# Altium project ESP_32_MacroPad.PrjPcb
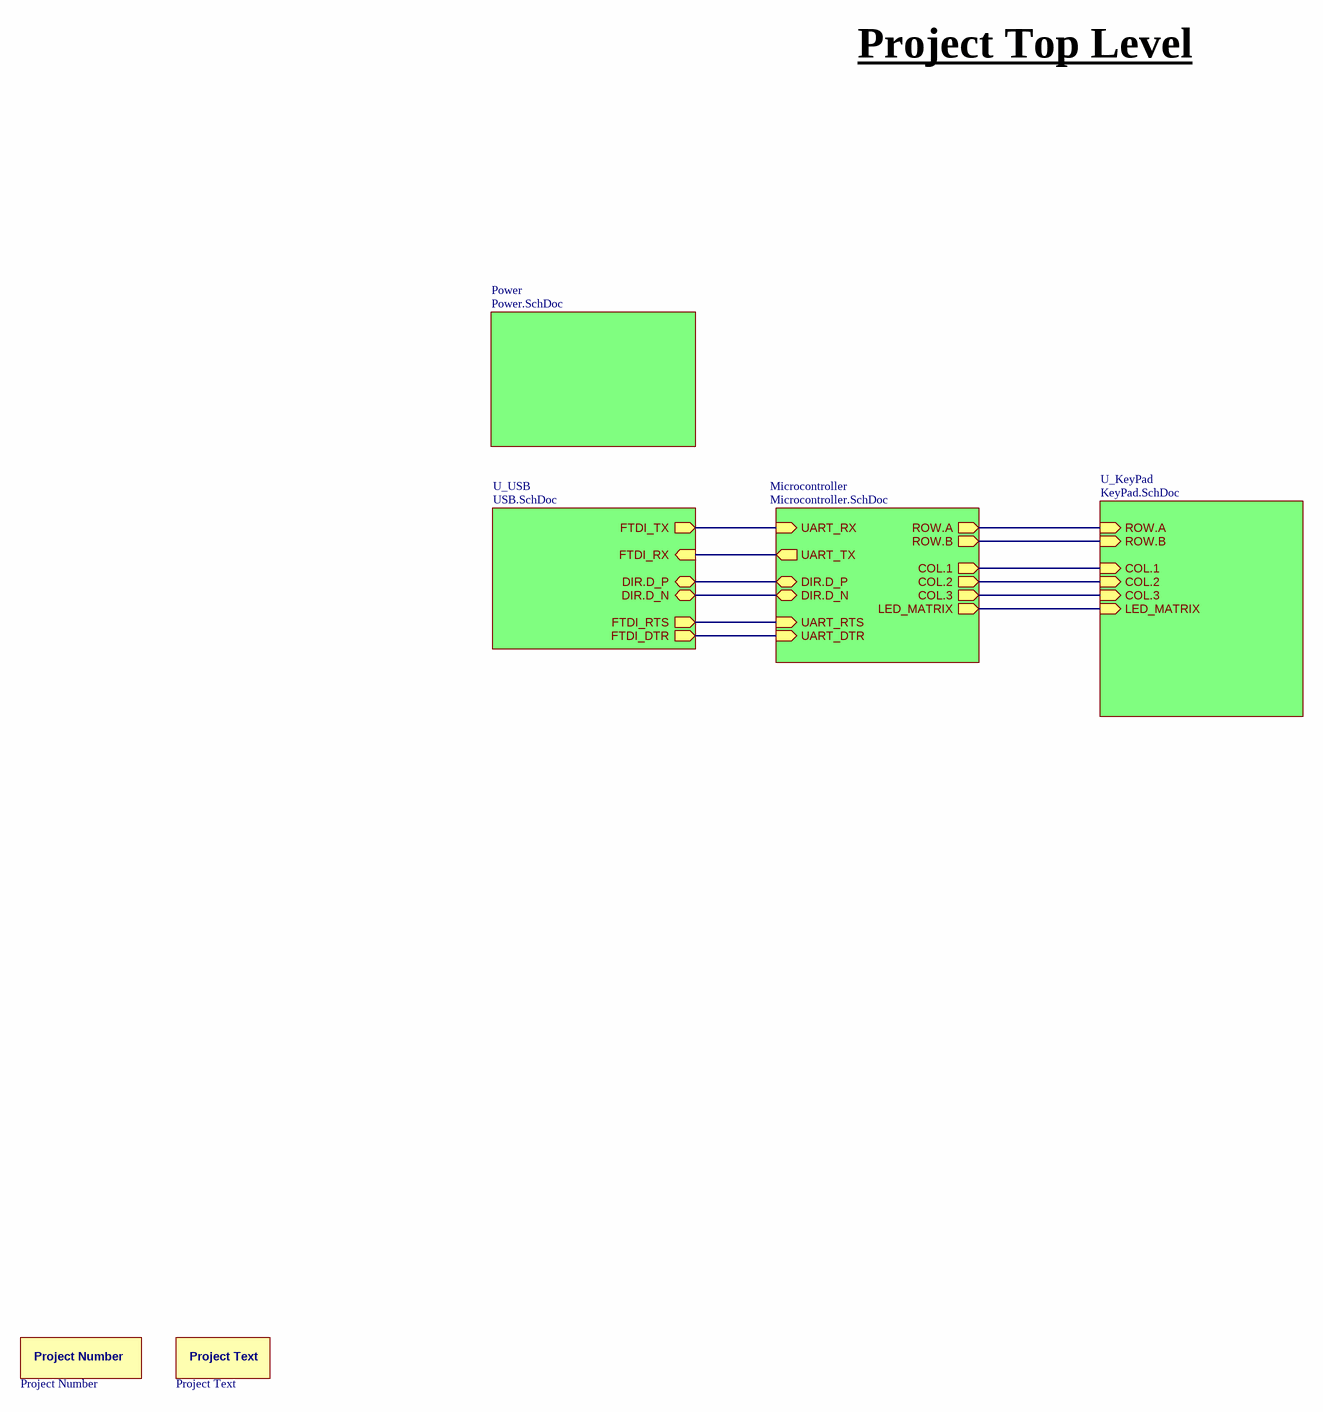
[diagram p0: Top.SchDoc]
CheckedDate: -; DesignDate: 05/03/2025; DesignYear: 2025; Project: ESP MACRO; ProjectNumber: RON-01; ProjectRevision: 0; ProjectStatus: DRAFT
5 sheets, 80 parts. Net scope: hierarchical (ports join the sheet entries above them; power ports are global).
Board files: ESP-MACRO-1.PcbDoc, 24-EL-MISC-Panel.PcbDoc
Sheets:
  Top.SchDoc
    Power = Power.SchDoc
    Microcontroller = Microcontroller.SchDoc
    U_USB = USB.SchDoc
    U_KeyPad = KeyPad.SchDoc

## Sheet Top.SchDoc
size 420 x 297 mm; Date: UNUSED; CompanyName: CMT; DrawnBy: UNUSED; Engineer: UNUSED; Organization: Curtin Motorsport Team; Address1: Rm 151 Building 206; Address2: Curtin University; Address3: Kent Street, Bentley; Address4: Western Australia; DocumentNumber: UNUSED; Revision: UNUSED; SheetNumber: 1; SheetTotal: 5; Year: UNUSED; SheetSize: A3; Time: UNUSED; ImagePath: UNUSED; Application_BuildNumber: UNUSED

### Parts
LOGO1  Project Number  [Project Number Overlay]  (no BOM)
LOGO2  Project Text  [Project Text-Footprint-1]  (no BOM)

### Sub-sheets
Microcontroller = Microcontroller.SchDoc: UART_RX (in), UART_TX (out), DIR.D_P (bidir), DIR.D_N (bidir), LED_MATRIX (out), COL.3 (out), COL.2 (out), COL.1 (out), ROW.B (out), ROW.A (out), UART_RTS (in), UART_DTR (in)
Power = Power.SchDoc: no entries
U_KeyPad = KeyPad.SchDoc: ROW.A (in), ROW.B (in), COL.1 (in), COL.2 (in), COL.3 (in), LED_MATRIX (in)
U_USB = USB.SchDoc: FTDI_TX (out), FTDI_RX (in), DIR.D_P (bidir), DIR.D_N (bidir), FTDI_RTS (out), FTDI_DTR (out)

### Nets
CBUS3: sheet Microcontroller/UART_DTR, sheet U_USB/FTDI_DTR
DIR.D_N: sheet Microcontroller/DIR.D_N, sheet U_USB/DIR.D_N
DIR.D_P: sheet Microcontroller/DIR.D_P, sheet U_USB/DIR.D_P
IO.8: sheet Microcontroller/ROW.B, sheet U_KeyPad/ROW.B
RXD: sheet Microcontroller/UART_TX, sheet U_USB/FTDI_RX
TXD: sheet Microcontroller/UART_RX, sheet U_USB/FTDI_TX
NetD3_1: sheet Microcontroller/COL.1, sheet U_KeyPad/COL.1
NetD4_1: sheet Microcontroller/COL.2, sheet U_KeyPad/COL.2
NetD5_1: sheet Microcontroller/COL.3, sheet U_KeyPad/COL.3
NetIC2_16: sheet Microcontroller/UART_RTS, sheet U_USB/FTDI_RTS
NetS1_1: sheet Microcontroller/ROW.A, sheet U_KeyPad/ROW.A
NetU1_18: sheet Microcontroller/LED_MATRIX, sheet U_KeyPad/LED_MATRIX

### Notes on the sheet
- Project Top Level
- Project:
- Title:
- Project Number:
- Size:
- Status:
- Revision:
- Year:
- Design Date:
- Author:
- Latest Revision Date:
- Sheet
- Checked:
- Checked
- of
- Date:

### Library data of the parts
LOGO1 = CMP-00004-5: Project Number Logo
LOGO2 = LOGO-00003-2

## Sheet Power.SchDoc: POWER
size 420 x 297 mm; Date: UNUSED; Author: RTU; CompanyName: CMT; DrawnBy: UNUSED; Engineer: UNUSED; Organization: Curtin Motorsport Team; Address1: Rm 151 Building 206; Address2: Curtin University; Address3: Kent Street, Bentley; Address4: Western Australia; DocumentNumber: UNUSED; Revision: UNUSED; SheetNumber: 2; SheetTotal: 5; Year: UNUSED; SheetSize: A3; Time: UNUSED; ImagePath: UNUSED; Application_BuildNumber: UNUSED
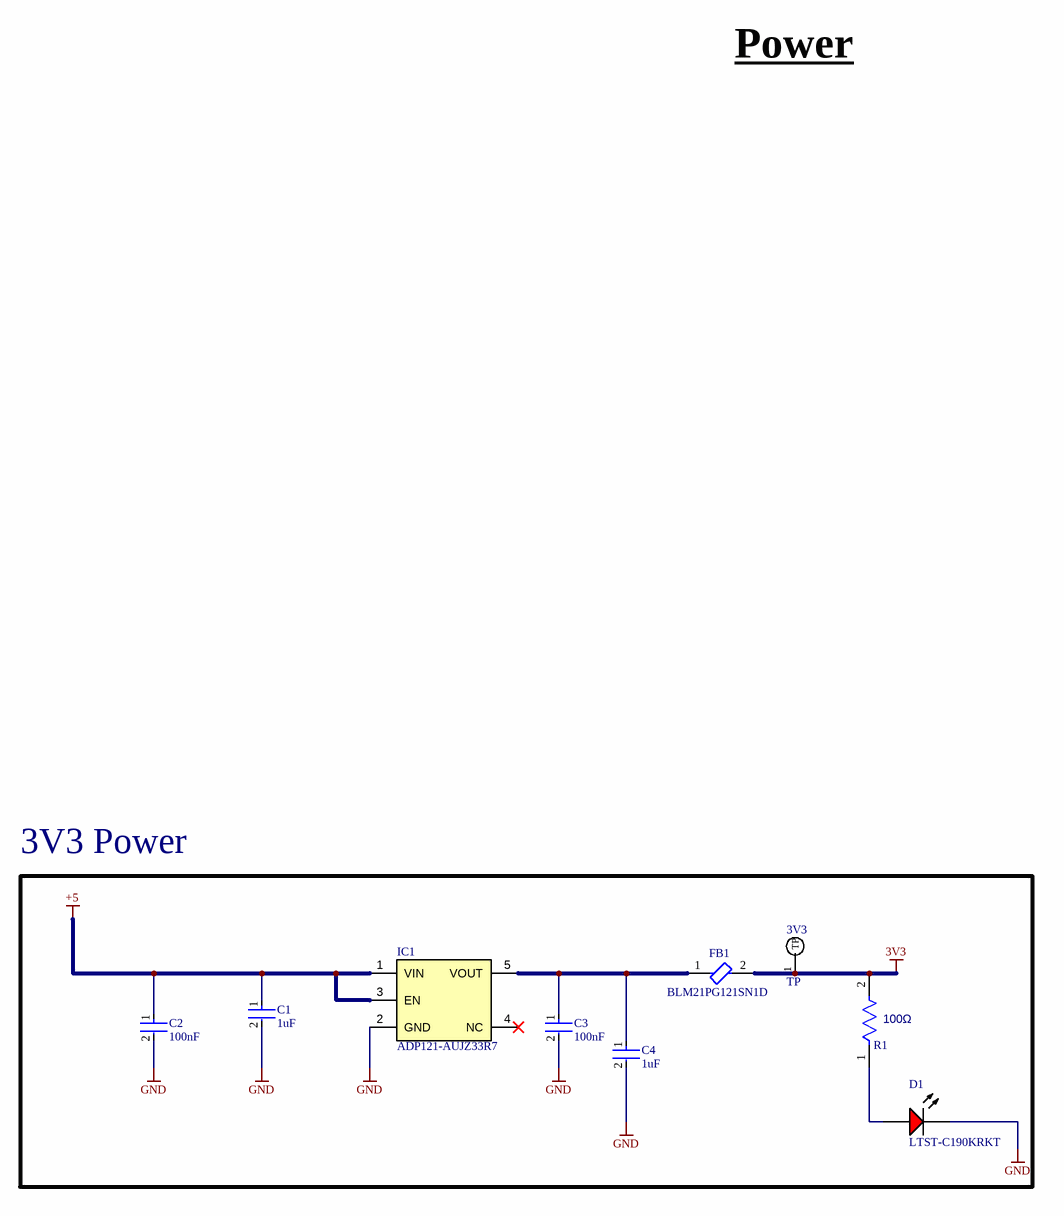
[diagram p1: Power.SchDoc]

### Parts
3V3  TP  [TestPad]
C1  1uF  [FP-CC0603-DA-MFG]
C2  100nF  [FP-GRM188-0_1-e0_2_0_55-IPC_A]
C3  100nF  [FP-GRM188-0_1-e0_2_0_55-IPC_A]
C4  1uF  [FP-CC0603-DA-MFG]
D1  LTST-C190KRKT  [LTST-C191KRKT_V]
FB1  BLM21PG121SN1D  [FP-BLM21-0_2-t0_85-e0_5-d-IPC_B]
IC1  ADP121-AUJZ33R7  [SOT95P280X100-5N]
R1  Resistance: 100Ω  [FP-RC0603-0_55-IPC_A]  (hidden comment: RC0603FR-07100RL)

### Blocks framed on the sheet
3V3 Power: 3V3 C1-C4 D1 FB1 IC1 R1

### Nets
3V3: 3V3.1(TP) FB1.2 R1.2
+5: C1.1 C2.1 IC1.1(VIN) IC1.3(EN)
GND: C1.2 C2.2 C3.2 C4.2 D1.2(K) IC1.2(GND)
NetC3_1: C3.1 C4.1 FB1.1 IC1.5(VOUT)
NetD1_1: D1.1(A) R1.1

Not connected (* = marked no-connect by the designer): IC1 4(NC)*

### Notes on the sheet
- Power
- Project:
- Title:
- Project Number:
- Size:
- Status:
- Revision:
- Year:
- Design Date:
- Author:
- Latest Revision Date:
- Sheet
- Checked:
- Checked
- of
- Date:

### Library data of the parts
3V3 = Test Points
C1 C4 = CMP-03422-000924-1: CAP CER 1UF 16V X7R 0603; Manufacturer: YAGEO; Manufacturer Part Number: CC0603KRX7R7BB105; Tolerance: 0.1; Temperature Coefficient: 15%; Material: Ceramic; Package: CC0603-DA; RoHS: TRUE; Device Class L2: Capacitors; Temperature Characteristic: X7R; Temperature: -55°C to +125°C; Temperature Range Low: -55°C; Automotive: No; ComponentLink2Description: Datasheet; Value: 1 uF; Lead Free: Yes; Capacitance: 1 uF; ComponentLink2URL: http://www.yageo.com/documents/recent/UPY-GPHC_X7R_6.3V-to-50V_18.pdf; Device Class L1: Passive Components; Voltage: 16 V; Octopart: https://octopart.com/cc0603krx7r7bb105-yageo-42271928; Category: Cap; Digikey Description: CAP CER 1UF 16V X7R 0603; Footprint Url: http://www.yageo.com/exep/pages/download/literatures/UPY-C_GEN_24.pdf; Height: 0.9mm; Voltage Rating: 16 V; Temperature Range High: +125°C; Mouser Description: Multilayer Ceramic Capacitor, CC Series, 1 - F, - 10%, X7R, 16 V, 0603 [1608 Metric]; Device Class L3: Ceramic Capacitors
C2 C3 = CMP-2006-02792-2: Chip Multilayer Ceramic Capacitors for General Purpose, 0603, 10uF, X5R, 15%, 20%, 6.3V; Packaging: Tape and Reel; Voltage Rating (DC): 6.3V; Width: 0.031inch; Termination: SMD/SMT; Dielectric: X5R; Package Quantity: 4000; Voltage Rating: 6.3V; Capacitance: 10uF; Case/Package: 0603; Min Operating Temperature: -55°C; Voltage: 6.3V; Length: 1.6mm; Thickness: 0.035inch; Lead Free: Lead Free; Depth: 0.8mm; Case Code (Imperial): 0603; Max Operating Temperature: 85°C; Material: Ceramic; Height: 0.8mm; Tolerance: 20%; Mount: Surface Mount; REACH SVHC: No SVHC; Radiation Hardening: No; Case Code (Metric): 1608
D1 = CMP-007-00024-3: LED Uni-Color Red, 62.5 mW, 25 mA, -30 to 85 degC, 2-Pin SMD, RoHS, Tape and Reel; Manufacturer: Lite-On; Manufacturer_Name: Vishay; Power: 75mW; Forward Voltage: 2V; Luminous Intensity: 54mcd; Lens Style: Diffused; Viewing Angle: 130degrees; Forward Current: 20mA; Manufacturer URL: http://www.us.liteon.com/; Case/Package: 0603; Datasheet Version: Rev. F, 05/2013; Package Reference: C191KRKT; Datasheet URL: http://optoelectronics.liteon.com/upload/download/DS-22-99-0151/S_110_LTST-C190KRKT.pdf; Package Description: 2-Pin Surface Mount Device, Body 1.6 x 0.8 mm; Nominal Vf: 2V; Packaging: TapeandReel; RoHS Compliant: True; Pins: 2; Illumination Colour: Red; Colour: Red; Mounting Technology: SM; Package Quantity: 3000; Min Operating Temperature: -55°C; Max Operating Temperature: 85°C; Manufacturer_Part_Number: LTST-C190KRKT
FB1 = CMP-00002-2: Ferrite Beads Multi-Layer 120Ohm 25% 100MHz 3A 30mOhm DCR 0805 Paper T/R; Manufacturer_Name: Murata; Material: Steel,Ferrite; DC Resistance (DCR): 30mR; Impedance: 120R; Case/Package: 0805; Case Code (Imperial): 0805; Min Operating Temperature: -55°C; Max Operating Temperature: 125°C; Current Rating: 3A; Manufacturer_Part_Number: BLM21PG121SN1D
IC1 = CMP-009-000019-2: Integrated Circuit; Manufacturer_Name: Analog Devices; Manufacturer_Part_Number: ADP121-AUJZ33R7; Datasheet Link: https://datasheet.lcsc.com/szlcsc/Analog-Devices-ADI-ADP121-AUJZ33R7_C50499.pdf; Source: SamacSys.SchLib; Mouser Price/Stock: https://www.mouser.co.uk/ProductDetail/Analog-Devices/ADP121-AUJZ33R7?qs=BpaRKvA4VqHby1qhPTxfCw%3D%3D; Design Item ID: ADP121-AUJZ33R7; Height: 1mm; Mouser Part Number: 584-ADP121-AUJZ33R7
R1 = CMP-2100-03663-2: NexarPartId: 55402879; Tolerance: 1%; Voltage Rating (DC): 50V; Power Rating: 100mW; Temperature Coefficient: 100ppm/°C; Number of Pins: 2; Height: 450µm; Military Standard: Not; Case Code (Imperial): 0603; Termination: SMD/SMT; Lead Free: Lead Free; Max Operating Temperature: 155°C; Case Code (Metric): 0603; Voltage Rating: 50V; Width: 800µm; Composition: Thick Film; Depth: 800µm; REACH SVHC: Unknown; Min Operating Temperature: -55°C; Packaging: Tape & Reel; Length: 1.6mm; Case/Package: 0603; RoHS: Compliant; Schedule B: 8533210045, 8533210045|8533210045|8533210045|8533210045|8533210045|8533210045|8533210045|8533210045|8533210045|8533210045|8533210045|8533210045|8533210045|8533210045|8533210045|8533210045|8533210045|8533210045|8533210045|8533210045|8533210045|8533210045|8533210045|85

## Sheet Microcontroller.SchDoc: Micro
size 420 x 297 mm; Date: UNUSED; CompanyName: CMT; DrawnBy: UNUSED; Engineer: UNUSED; Organization: Curtin Motorsport Team; Address1: Rm 151 Building 206; Address2: Curtin University; Address3: Kent Street, Bentley; Address4: Western Australia; DocumentNumber: UNUSED; Revision: UNUSED; SheetNumber: 3; SheetTotal: 5; Year: UNUSED; SheetSize: A3; Time: UNUSED; ImagePath: UNUSED; Application_BuildNumber: UNUSED
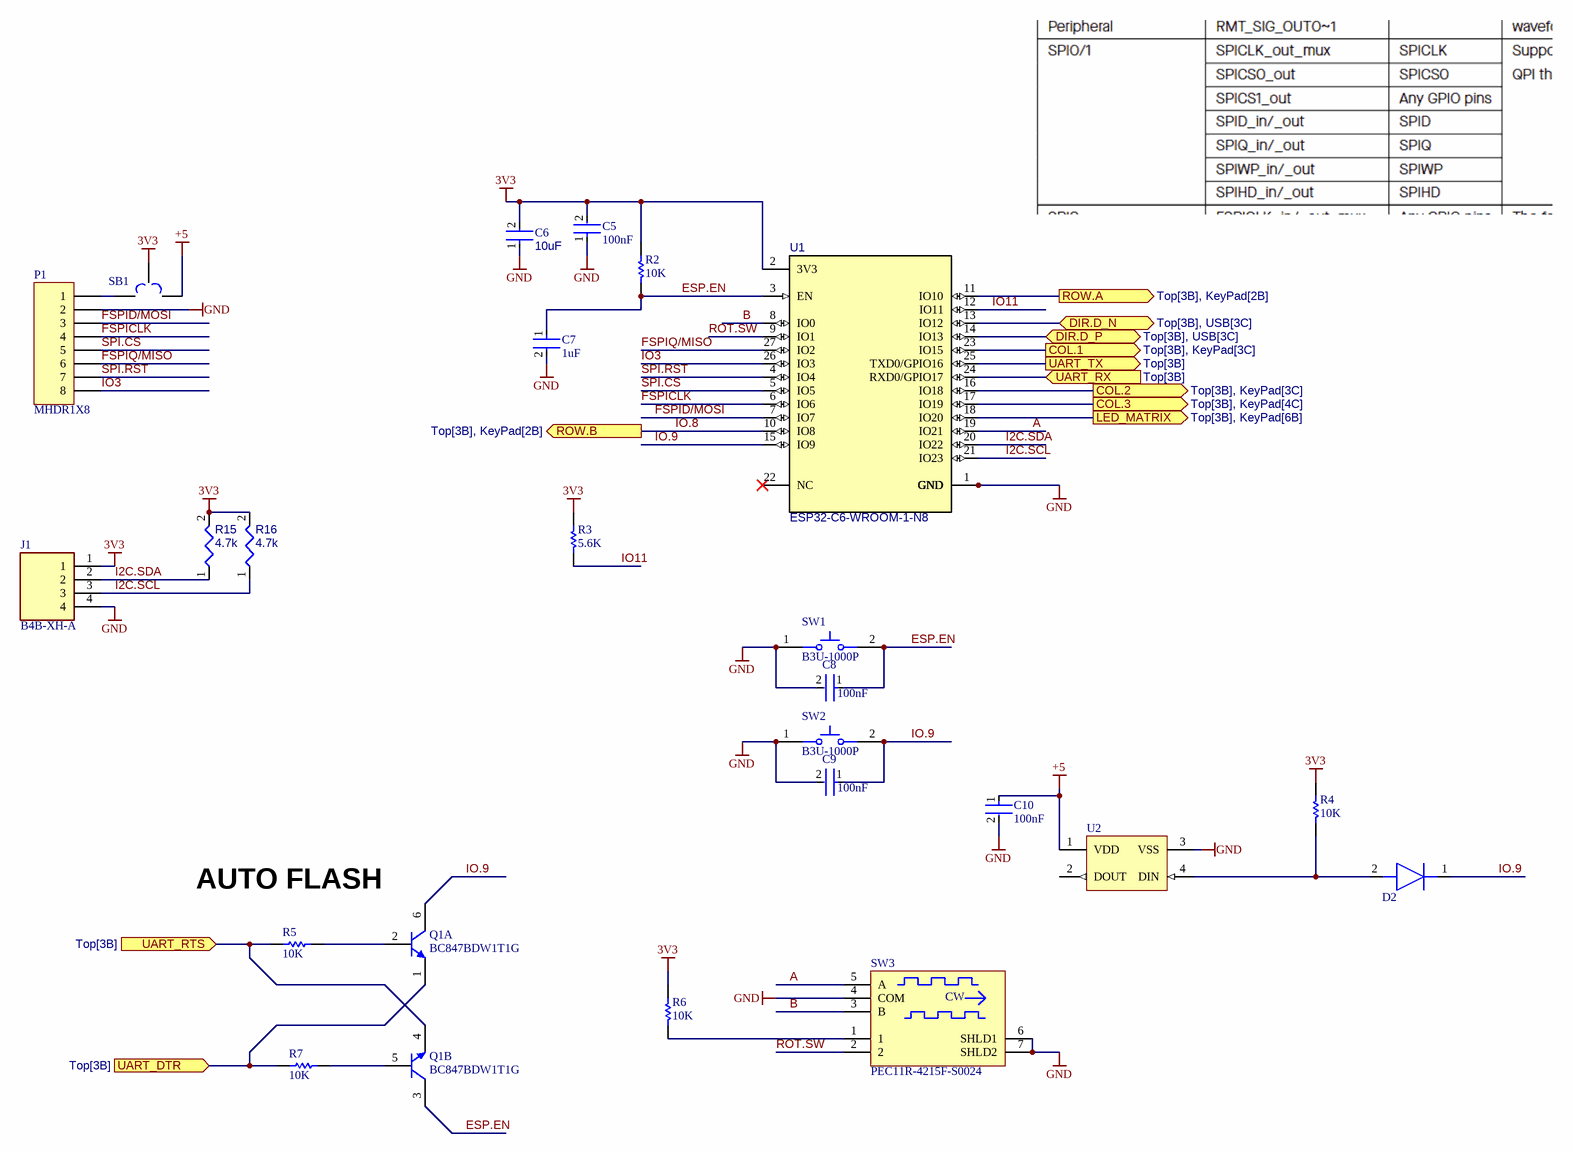
[diagram p2: Microcontroller.SchDoc]

### Parts
C5  100nF  [FP-GRM188-0_1-e0_2_0_55-IPC_A]
C6  Capacitance: 10uF  [FP-C1608-080-IPC_A]  (hidden comment: C1608X5R1E106M080AC)
C7  1uF  [FP-CC0603-DA-MFG]
C8  100nF  [FP-GRM188-0_1-e0_2_0_55-IPC_A]
C9  100nF  [FP-GRM188-0_1-e0_2_0_55-IPC_A]
C10  100nF  [FP-GRM188-0_1-e0_2_0_55-IPC_A]
D2  NSVR1020MW2T1G  [SOD2512X110N]  (value not drawn)
J1  B4B-XH-A  [B4BXHA]
P1  MHDR1X8  [MHDR1X8]
Q1  BC847BDW1T1G  [ONSC-SOT-363-6-419B-02_W_V]  (parts A,B of 2)
R2  10K  [RESC1609X50X30NL10T20]
R3  5.6K  [RESC1609X50X30NL10T20]
R4  10K  [RESC1609X50X30NL10T20]
R5  10K  [RESC1609X50X30NL10T20]
R6  10K  [RESC1609X50X30NL10T20]
R7  10K  [RESC1609X50X30NL10T20]
R15  value 4.7k  [RESC1608X55X25ML10T15]  (hidden comment: Resistor 4k7 +/-1% 0603 100 mW)
R16  value 4.7k  [RESC1608X55X25ML10T15]  (hidden comment: Resistor 4k7 +/-1% 0603 100 mW)
SB1  3 POS Solder Bridge  [3 POS Solder Bridge-Footprint-1]  (value not drawn)  (no BOM)
SW1  B3U-1000P  [OMRON-B3U-1000_V]
SW2  B3U-1000P  [OMRON-B3U-1000_V]
SW3  PEC11R-4215F-S0024  [BOUR-PEC11R-4XXXF-SXXXX_V]
U1  ESP32-C6-WROOM-1-N8  [ESP32-C6-WROOM-1-N8-Footprint-1]
U2  WS2812B  [ADAI-WS2812B_V]  (value not drawn)

### Ports
COL.1 (out, see Top[3B], KeyPad[3C]), COL.2 (out, see Top[3B], KeyPad[3C]), COL.3 (out, see Top[3B], KeyPad[4C]), DIR.D_N (bidir, see Top[3B], USB[3C]), DIR.D_P (bidir, see Top[3B], USB[3C]), LED_MATRIX (out, see Top[3B], KeyPad[6B]), ROW.A (out, see Top[3B], KeyPad[2B]), ROW.B (out, see Top[3B], KeyPad[2B]), UART_DTR (in, see Top[3B]), UART_RTS (in, see Top[3B]), UART_RX (in, see Top[3B]), UART_TX (out, see Top[3B])

### Nets
3V3: C5.2 C6.2 J1.1 R2.1 R3.1 R4.1 R6.1 R15.2 R16.2 SB1.2 U1.2(3V3)
+5: C10.1 SB1.3 U2.1(VDD)
GND: C5.1 C6.1 C7.2 C8.2 C9.2 C10.2 J1.4 P1.2 SW1.1 SW2.1 SW3.4(COM) SW3.6(SHLD1) SW3.7(SHLD2) U1.1(GND) U1.28(GND) U1.29_1(GND) U1.29_2(GND) U1.29_3(GND) U1.29_4(GND) U1.29_5(GND) U1.29_6(GND) U1.29_7(GND) U1.29_8(GND) U1.29_9(GND) U2.3(VSS)
A: SW3.5(A) U1.19(IO21)
B: SW3.3(B) U1.8(IO0)
CBUS3: Q1.1(E) R7.1 ; port UART_DTR
DIR.D_N: U1.13(IO12) ; port DIR.D_N
DIR.D_P: U1.14(IO13) ; port DIR.D_P
ESP.EN: C7.1 C8.1 Q1.3(C) R2.2 SW1.2 U1.3(EN)
FSPICLK: P1.4 U1.6(IO6)
FSPID/MOSI: P1.3 U1.7(IO7)
FSPIQ/MISO: P1.6 U1.27(IO2)
I2C.SCL: J1.3 R16.1 U1.21(IO23)
I2C.SDA: J1.2 R15.1 U1.20(IO22)
IO3: P1.8 U1.26(IO3)
IO11: R3.2 U1.12(IO11)
IO.8: U1.10(IO8) ; port ROW.B
IO.9: C9.1 D2.1(K) Q1.6(C) SW2.2 U1.15(IO9)
ROT.SW: SW3.2 U1.9(IO1)
RXD: U1.25(TXD0/GPIO16) ; port UART_TX
SPI.CS: P1.5 U1.5(IO5)
SPI.RST: P1.7 U1.4(IO4)
TXD: U1.24(RXD0/GPIO17) ; port UART_RX
NetD2_2: D2.2(A) R4.2 U2.4(DIN)
NetD3_1: U1.23(IO15) ; port COL.1
NetD4_1: U1.16(IO18) ; port COL.2
NetD5_1: U1.17(IO19) ; port COL.3
NetIC2_16: Q1.4(E) R5.1 ; port UART_RTS
NetP1_1: P1.1 SB1.1
NetQ1_2: Q1.2(B) R5.2
NetQ1_5: Q1.5(B) R7.2
NetR6_2: R6.2 SW3.1
NetS1_1: U1.11(IO10) ; port ROW.A
NetU1_18: U1.18(IO20) ; port LED_MATRIX

Not connected (* = marked no-connect by the designer): U1 22(NC)*; U2 2(DOUT)

### Notes on the sheet
- (near R5) AUTO FLASH
- Project:
- Title:
- Project Number:
- Size:
- Status:
- Revision:
- Year:
- Design Date:
- Author:
- Latest Revision Date:
- Sheet
- Checked:
- Checked
- of
- Date:
- (in symbol CMP-011-00007-2) CW

### Library data of the parts
C5 C8-C10 = CMP-2006-02792-2: as C2 on sheet Power; Packaging: Tape and Reel; Voltage Rating (DC): 6.3V; Width: 0.031inch; Termination: SMD/SMT; Dielectric: X5R; Package Quantity: 4000; Voltage Rating: 6.3V; Capacitance: 10uF; Case/Package: 0603; Min Operating Temperature: -55°C; Voltage: 6.3V; Length: 1.6mm; Thickness: 0.035inch; Lead Free: Lead Free; Depth: 0.8mm; Case Code (Imperial): 0603; Max Operating Temperature: 85°C; Material: Ceramic; Height: 0.8mm; Tolerance: 20%; Mount: Surface Mount; REACH SVHC: No SVHC; Radiation Hardening: No; Case Code (Metric): 1608
C6 = CMP-2000-05442-2: CAP CER 10UF 25V X5R 0603; Dielectric Material: Ceramic; Tolerance: 20%; Dielectric: X5R; Length: 1.6mm; Termination: SMD/SMT; Depth: 0.8mm; RoHS Compliant: Yes; Construction: Flat; Weight: 7.1E-05oz; Thickness: 0.039inch; Packaging: Tape and Reel; Min Operating Temperature: -55°C; Case Code (Imperial): 0603; Case/Package: 0603; Height: 0.8mm; Case Code (Metric): 1608; Voltage Rating: 25V; Resistor Type: Ceramic; Voltage Rating (DC): 25V; Max Operating Temperature: 85°C; REACH SVHC: No SVHC; Lead Free: Lead Free; Series: C; Width: 0.8mm; Mount: Surface Mount; Package Quantity: 1
C7 = CMP-03422-000924-1: as C1 on sheet Power; Package: CC0603-DA; RoHS: TRUE; Device Class L2: Capacitors; Temperature Characteristic: X7R; Temperature: -55°C to +125°C; Temperature Range Low: -55°C; Automotive: No; ComponentLink2Description: Datasheet; Value: 1 uF; Lead Free: Yes; Capacitance: 1 uF; ComponentLink2URL: http://www.yageo.com/documents/recent/UPY-GPHC_X7R_6.3V-to-50V_18.pdf; Device Class L1: Passive Components; Voltage: 16 V; Octopart: https://octopart.com/cc0603krx7r7bb105-yageo-42271928; Category: Cap; Digikey Description: CAP CER 1UF 16V X7R 0603; Footprint Url: http://www.yageo.com/exep/pages/download/literatures/UPY-C_GEN_24.pdf; Height: 0.9mm; Voltage Rating: 16 V; Temperature Range High: +125°C; Mouser Description: Multilayer Ceramic Capacitor, CC Series, 1 - F, - 10%, X7R, 16 V, 0603 [1608 Metric]; Device Class L3: Ceramic Capacitors
D2 = CMP-020-000003-1: Diode; Manufacturer_Name: onsemi; Design Item ID: NSVR1020MW2T1G; Datasheet Link: http://www.onsemi.com/pub/Collateral/NSR1020MW2T1-D.PDF; Arrow Price/Stock: https://www.arrow.com/en/products/nsvr1020mw2t1g/on-semiconductor; Height: 1.1mm; Mouser Part Number: 863-NSVR1020MW2T1G; Mouser Price/Stock: https://www.mouser.co.uk/ProductDetail/onsemi/NSVR1020MW2T1G?qs=tCMd4XlZ%2FiDUu7qH%252Bxas4w%3D%3D; Manufacturer_Part_Number: NSVR1020MW2T1G; Source: SamacSys.SchLib; Arrow Part Number: NSVR1020MW2T1G
J1 = CMP-019-000017-1: Connector; Manufacturer_Name: JST (JAPAN SOLDERLESS TERMINALS); Height: 7mm; Datasheet Link: https://www.jst-mfg.com/product/pdf/eng/eXH.pdf; Design Item ID: B4B-XH-A; Manufacturer_Part_Number: B4B-XH-A; Source: SamacSys.SchLib
P1 = CMP-011-000321-1: Header, 8-Pin; Signal Integrity: Connector; LatestRevisionDate: 17-Jul-2002; Publisher: Altium Limited; LatestRevisionNote: Re-released for DXP Platform.; Source: Miscellaneous Connectors.SchLib; Component Type: Standard; Pin Count: 8; Design Item ID: MHDR1X8
Q1 = CMP-1048-00875-1: Dual General Purpose Transistors, NPN, 6-Pin SOT-363, Pb-Free, Tape and Reel; Manufacturer: On Semiconductor; fT Min (MHz): 100; IC Continuous (A): 0.1; Polarity: Dual NPN; ComponentLink3Description: Package Specification; PackageReference: SOT-363-6-419B-02_W; RoHS: TRUE; PackageVersion: Rev. W, 01/2006; Packing: Tape and Reel; Mounting Technology: Surface Mount; ComponentLink3URL: http://www.onsemi.com/pub_link/Collateral/NTJD4001N-D.PDF; ComponentLink2URL: http://www.onsemi.cn/pub_link/Collateral/BC846BDW1T1-D.PDF; ComponentLink2Description: Datasheet; ComponentLink1Description: Manufacturer URL; PartNumber: BC847BDW1T1G; DatasheetVersion: Rev. 9; PackageDescription: 6-Pin Small Outline Transistor, Body 2 x 1.25 mm, Pitch 0.65 mm; ComponentLink1URL: http://www.onsemi.com/
R2-R7 = CMP-1012-00708-2: Part Number: CRCW060356K0FKEA; Manufacturer: Vishay Dale
R15 R16 = CMP-009-00031-7: Chip Resistor, 4.7 KOhm, +/- 1%, 0.1 W, -55 to 155 degC, 0603 (1608 Metric); Manufacturer_Part_Number: RC0603FR-134K7L; Manufacturer_Name: Yageo; Power: 100mW; Min Operating Temperature: -55°C; Case/Package: 0603; RoHS Compliant: True; Tolerance: 1%; Max Operating Temperature: 155°C; Pins: 2; Mounting Technology: SM
SB1 = CMP-016-000000-3: 3 position solder bridge; Source: StrainComponents.SchLib; Design Item ID: 3 POS SB
SW1 SW2 = CMP-011-00000-2: Tactile Switch, SPST-NO, 0.05 A, 12 V, -25 to 70 degC, 2-Pin SMD, RoHS, Tape and Reel; Manufacturer: Omron Electronic Components; IP Rating: IP40; Current Rating: 50mA; Max Contact Resistance: 100mohm; Operating Force: 153gf; Throw Configuration: SPST; Resistance: 0.1Ohm; Max Voltage Rating (DC): 12V; Contact Material: Silver; Max Current Rating: 50mA; Datasheet URL: http://www.omron.com/ecb/products/pdf/en-b3u.pdf; Mounting Technology: SM; Case/Package: B3U-1000; Packaging: TapeandReel; Package Reference: B3U-1000; Manufacturer URL: http://www.omron.com/; Datasheet Version: Jan-15; RoHS Compliant: True; Max Operating Temperature: 70°C; Contact Current Rating: 50mA; Package Quantity: 3500; Package Description: 2-Pin Surface Mount Device, Body 3 x 2.5 mm; Voltage Rating (DC): 12V; Min Operating Temperature: -25°C; Voltage Rating: 12V
SW3 = CMP-011-00007-2: 12 mm Incremental Encoder, 24 Detent, -30 to 70 degC, 5-Pin THD, RoHS, Bulk; Manufacturer: Bourns; Channels: 2; RoHS Compliant: True; Product Type: Mechanical; Datasheet Version: Jul-14; Package Quantity: 150; Manufacturer URL: http://www.bourns.com/; Case/Package: PEC11R-4XXXF-SXXXX; Packaging: Bulk; Package Reference: PEC11R-4XXXF-SXXXX; Min Operating Temperature: -30°C; Max Operating Temperature: 70°C; Datasheet URL: http://www.bourns.com/docs/Product-Datasheets/PEC11R.pdf; Mounting Technology: TH; Package Description: 5-Pin Through Hole Device, Body 12.5 x 13.4 mm
U1 = CMP-021-00007-3: ESP32-C6-WROOM-1-N8 Engineering Module - 8 MB Quad SPI Flash; Nominal Supply Voltage: 3.3V; Frequency: 128MHz; Flash: 8 MB; Mounting Technology: SMT; Case/Package: 28-SMD Module; Pins: 28
U2 = CMP-007-00035-2: Intelligent Control LED Integrated Light Source, 3.5 to 5.3 V, -25 to 80 degC, 4-Pin SMD, RoHS, Bulk; Manufacturer: Adafruit Industries; Datasheet URL: https://cdn-shop.adafruit.com/datasheets/WS2812B.pdf; Manufacturer URL: https://www.adafruit.com/; Datasheet Version: May-13; Case/Package: WS2812B; Mounting Technology: SM; RoHS Compliant: False; Package Description: 4-Pin Surface Mount Device, Body 5 x 5 mm, Pitch 3.3 mm; Package Reference: WS2812B

## Sheet USB.SchDoc
size 420 x 297 mm; Date: UNUSED; CompanyName: CMT; DrawnBy: UNUSED; Engineer: UNUSED; Organization: Curtin Motorsport Team; Address1: Rm 151 Building 206; Address2: Curtin University; Address3: Kent Street, Bently; Address4: Western Australia; DocumentNumber: UNUSED; Revision: UNUSED; SheetNumber: 5; SheetTotal: 5; Year: UNUSED; SheetSize: A3; Time: UNUSED; ImagePath: UNUSED; Application_BuildNumber: UNUSED
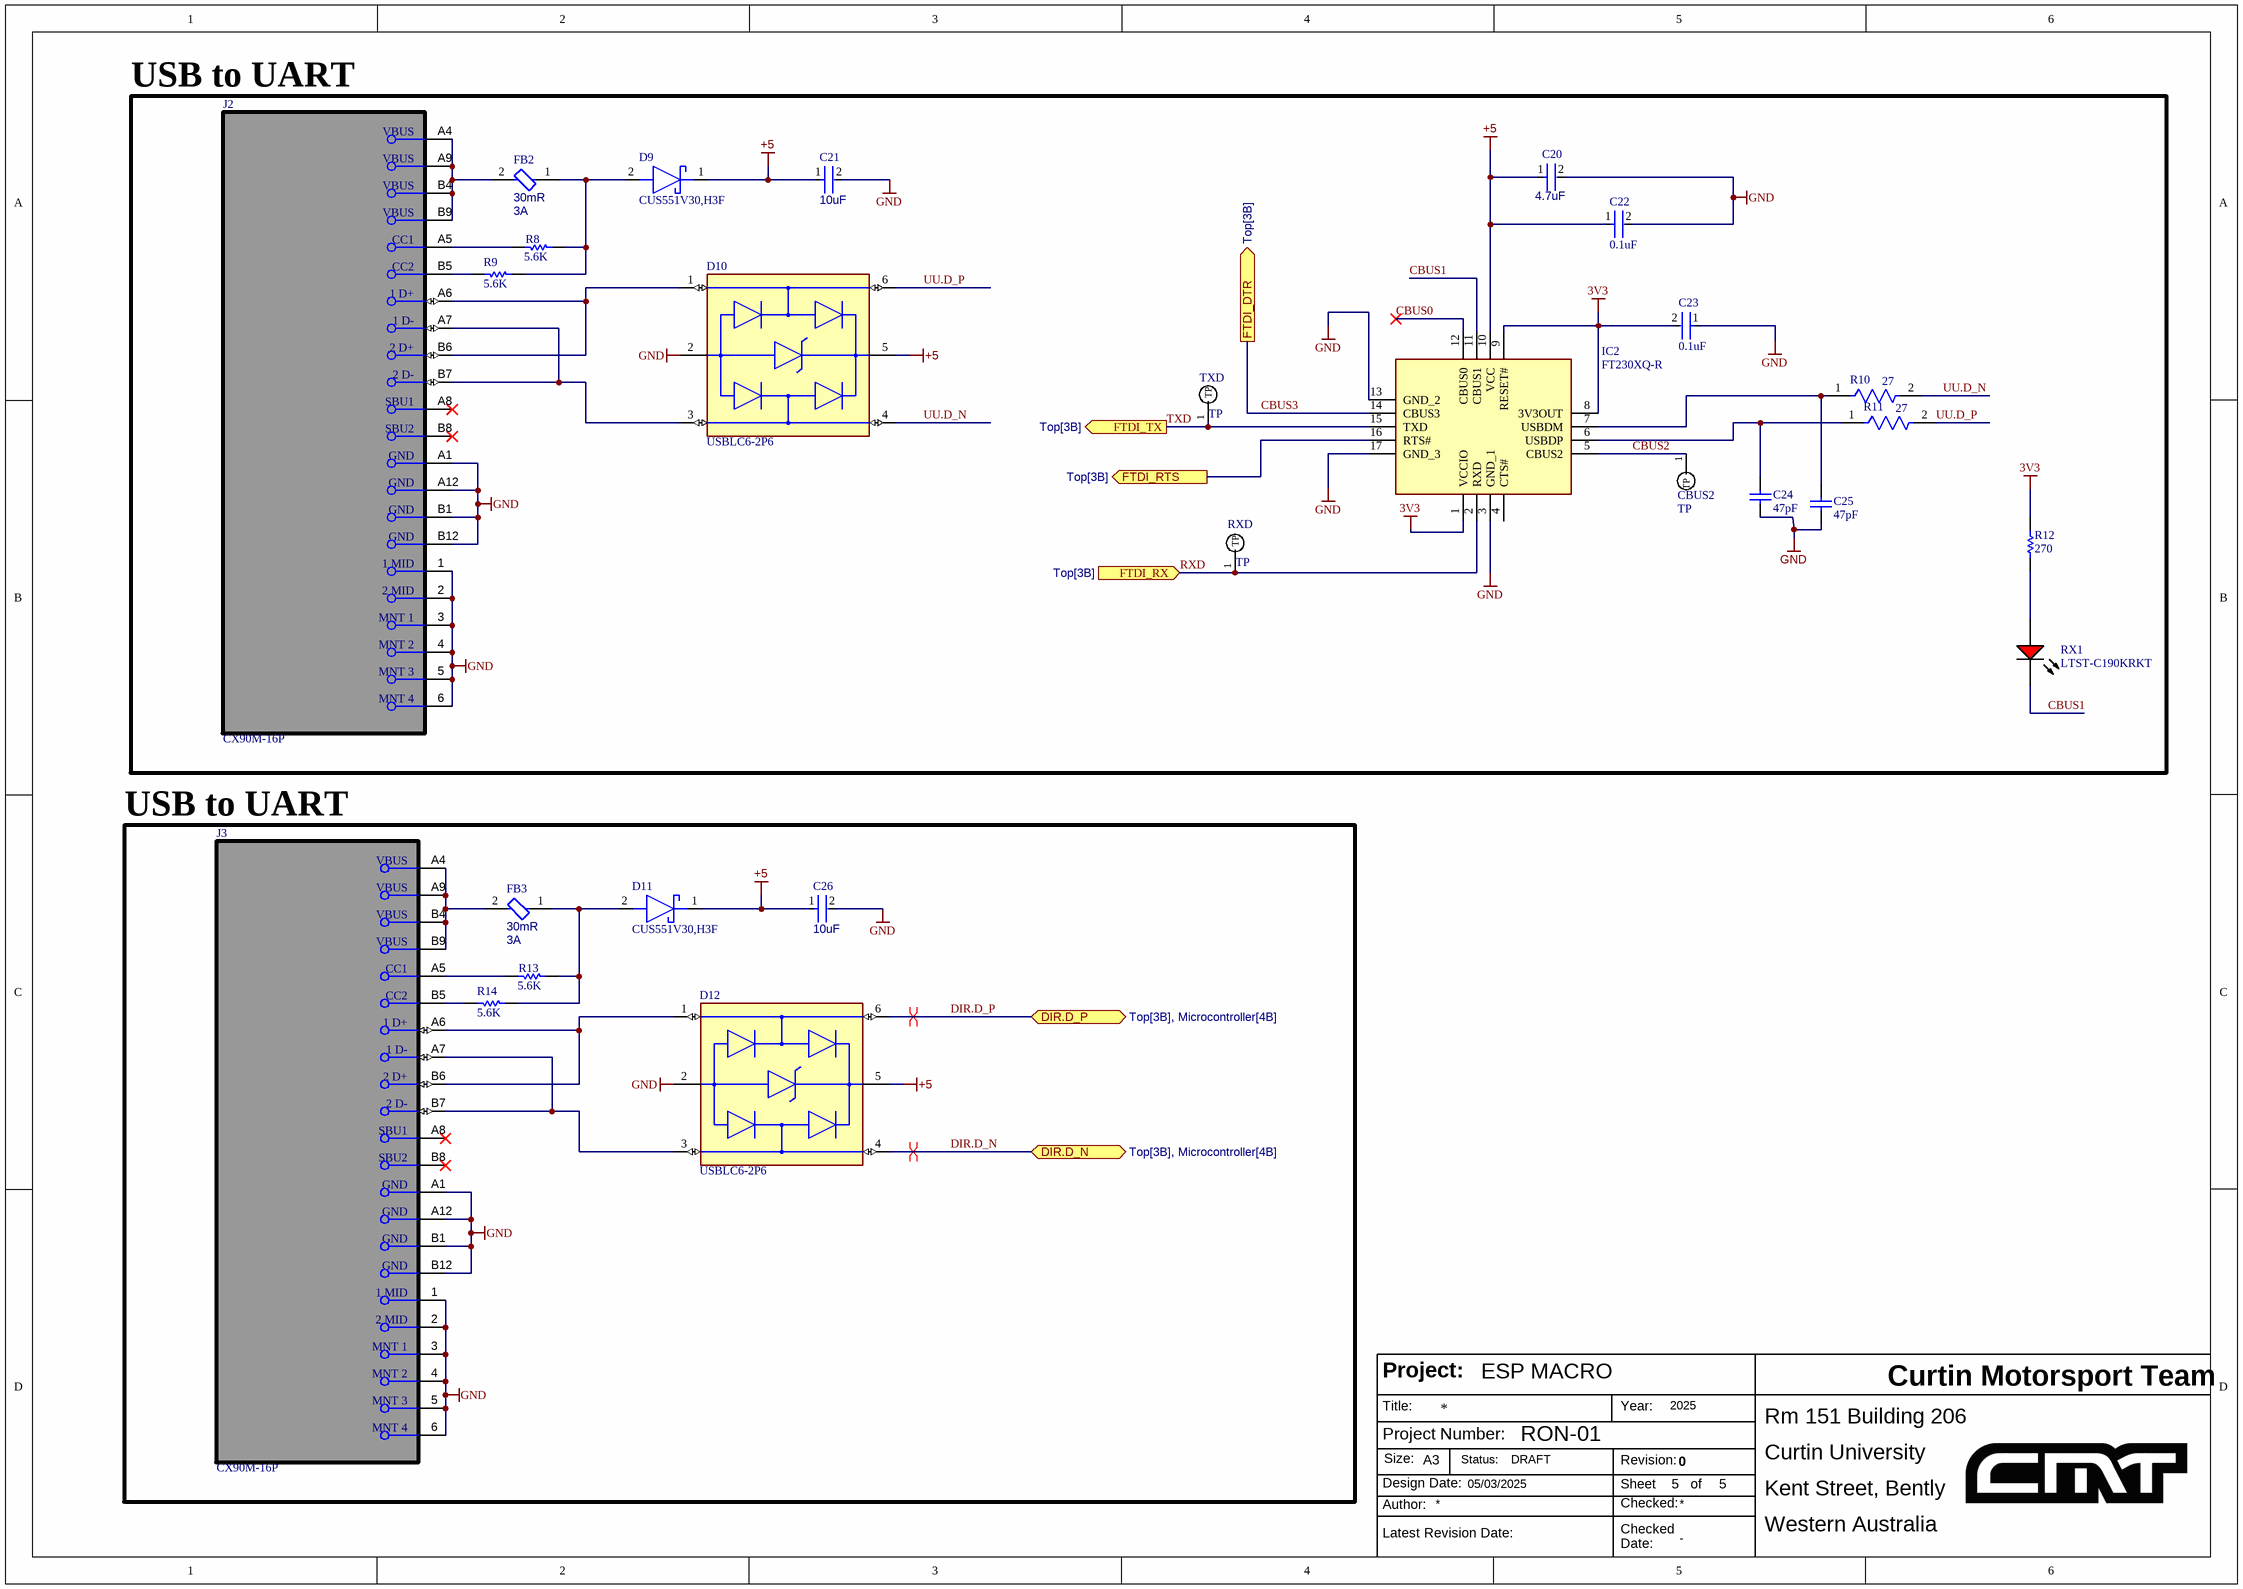
[diagram p3: USB.SchDoc]

### Parts
C20  Capacitance: 4.7uF  [FP-GRM188-0_15-IPC_C]  (hidden comment: GRM188R61E475KE11D)
C21  Capacitance: 10uF  [FP-C1608-080-IPC_A]  (hidden comment: C1608X5R1E106M080AC)
C22  0.1uF  [FP-C0603C-CF-MFG]
C23  0.1uF  [FP-C0603C-CF-MFG]
C24  47pF  [CAPC1608X90X35NL10T15]
C25  47pF  [CAPC1608X90X35NL10T15]
C26  Capacitance: 10uF  [FP-C1608-080-IPC_A]  (hidden comment: C1608X5R1E106M080AC)
CBUS2  TP  [TestPad]
D9  CUS551V30,H3F  [1SS357TPH3F]
D10  USBLC6-2P6  [FP-SOT-666-MFG]
D11  CUS551V30,H3F  [1SS357TPH3F]
D12  USBLC6-2P6  [FP-SOT-666-MFG]
FB2  DC Resistance (DCR): 30mR  Current Rating: 3A  [FP-BLM21-0_2-t0_85-e0_5-d-IPC_B]  (hidden comment: BLM21PG121SN1D)
FB3  DC Resistance (DCR): 30mR  Current Rating: 3A  [FP-BLM21-0_2-t0_85-e0_5-d-IPC_B]  (hidden comment: BLM21PG121SN1D)
IC2  FT230XQ-R  [QFN65P400X400X80-17N]
J2  CX90M-16P  [FP-CX90M-16P-MFG]
J3  CX90M-16P  [FP-CX90M-16P-MFG]
R8  5.6K  [RESC1609X50X30NL10T20]
R9  5.6K  [RESC1609X50X30NL10T20]
R10  27  [FP-ERJ3EK-IPC_B]
R11  27  [FP-ERJ3EK-IPC_B]
R12  270  [RESC1609X50X30NL10T20]
R13  5.6K  [RESC1609X50X30NL10T20]
R14  5.6K  [RESC1609X50X30NL10T20]
RX1  LTST-C190KRKT  [LTST-C191KRKT_V]
RXD  TP  [TestPad]
TXD  TP  [TestPad]

### Blocks framed on the sheet
USB to UART: C20-C25 CBUS2 D9 D10 FB2 IC2 J2 R8-R12 RX1 RXD TXD
USB to UART: C26 D11 D12 FB3 J3 R13 R14

### Ports
DIR.D_N (bidir, see Top[3B], Microcontroller[4B]), DIR.D_P (bidir, see Top[3B], Microcontroller[4B]), FTDI_DTR (out, see Top[3B]), FTDI_RTS (out, see Top[3B]), FTDI_RX (in, see Top[3B]), FTDI_TX (out, see Top[3B])

### Nets
3V3: C23.2 IC2.1(VCCIO) IC2.8(3V3OUT) IC2.9(RESET#) R12.2
+5: C20.1 C21.1 C22.1 C26.1 D9.1(K) D10.5(VBUS) D11.1(K) D12.5(VBUS) IC2.10(VCC)
GND: C20.2 C21.2 C22.2 C23.1 C24.1 C25.1 C26.2 D10.2(GND) D12.2(GND) IC2.3(GND_1) IC2.13(GND_2) IC2.17(GND_3) J2.1(1_MID) J2.2(2_MID) J2.3(MNT_1) J2.4(MNT_2) J2.5(MNT_3) J2.6(MNT_4) J2.A1(GND) J2.A12(GND) J2.B1(GND) J2.B12(GND) J3.1(1_MID) J3.2(2_MID) J3.3(MNT_1) J3.4(MNT_2) J3.5(MNT_3) J3.6(MNT_4) J3.A1(GND) J3.A12(GND) J3.B1(GND) J3.B12(GND)
CBUS0: IC2.12(CBUS0)
CBUS1: IC2.11(CBUS1) RX1.2(K)
CBUS2: CBUS2.1(TP) IC2.5(CBUS2)
CBUS3: IC2.14(CBUS3) ; port FTDI_DTR
DIR.D_N: D12.4(I/O2) ; port DIR.D_N
DIR.D_P: D12.6(I/O1) ; port DIR.D_P
RXD: IC2.2(RXD) RXD.1(TP) ; port FTDI_RX
TXD: IC2.15(TXD) TXD.1(TP) ; port FTDI_TX
UU.D_N: D10.4(I/O2) R10.2
UU.D_P: D10.6(I/O1) R11.2
NetC24_2: C24.2 IC2.6(USBDP) R11.1
NetC25_2: C25.2 IC2.7(USBDM) R10.1
NetD9_2: D9.2(A) FB2.1 R8.1 R9.2
NetD10_1: D10.1(I/O1) J2.A6(1_D+) J2.B6(2_D+)
NetD10_3: D10.3(I/O2) J2.A7(1_D-) J2.B7(2_D-)
NetD11_2: D11.2(A) FB3.1 R13.1 R14.2
NetD12_1: D12.1(I/O1) J3.A6(1_D+) J3.B6(2_D+)
NetD12_3: D12.3(I/O2) J3.A7(1_D-) J3.B7(2_D-)
NetFB2_2: FB2.2 J2.A4(VBUS) J2.A9(VBUS) J2.B4(VBUS) J2.B9(VBUS)
NetFB3_2: FB3.2 J3.A4(VBUS) J3.A9(VBUS) J3.B4(VBUS) J3.B9(VBUS)
NetIC2_16: IC2.16(RTS#) ; port FTDI_RTS
NetJ2_A5: J2.A5(CC1) R8.2
NetJ2_B5: J2.B5(CC2) R9.1
NetJ3_A5: J3.A5(CC1) R13.2
NetJ3_B5: J3.B5(CC2) R14.1
NetR12_1: R12.1 RX1.1(A)

Not connected (* = marked no-connect by the designer): IC2 4(CTS#); J2 A8(SBU1)* B8(SBU2)*; J3 A8(SBU1)* B8(SBU2)*

### Layout directives
differential pair: DIR.D_N, DIR.D_P

### Notes on the sheet
- Project:
- Title:
- Project Number:
- Size:
- Status:
- Revision:
- Year:
- Design Date:
- Author:
- Latest Revision Date:
- Sheet
- Checked:
- Checked
- of
- Date:

### Library data of the parts
C20 = CMP-2006-02523-2: Chip Multilayer Ceramic Capacitors for General Purpose, 0603, 4.7uF, X5R, 15%, 10%, 25V; Case Code (Metric): 1608; Max Operating Temperature: 85°C; REACH SVHC: No SVHC; Voltage Rating: 25V; Dielectric: X5R; Packaging: Cut Tape; Width: 0.031inch; Min Operating Temperature: -55°C; Lead Free: Lead Free; Height: 0.8mm; Case Code (Imperial): 0603; Length: 1.6mm; Voltage Rating (DC): 25V; Case/Package: 0603; Voltage: 25V; Tolerance: 10%; Thickness: 0.031inch; Mount: Surface Mount; Material: Ceramic; Package Quantity: 4000; Depth: 0.8mm
C21 C26 = CMP-2000-05442-2: as C6 on sheet Microcontroller; Dielectric: X5R; Length: 1.6mm; Termination: SMD/SMT; Depth: 0.8mm; RoHS Compliant: Yes; Construction: Flat; Weight: 7.1E-05oz; Thickness: 0.039inch; Packaging: Tape and Reel; Min Operating Temperature: -55°C; Case Code (Imperial): 0603; Case/Package: 0603; Height: 0.8mm; Case Code (Metric): 1608; Voltage Rating: 25V; Resistor Type: Ceramic; Voltage Rating (DC): 25V; Max Operating Temperature: 85°C; REACH SVHC: No SVHC; Lead Free: Lead Free; Series: C; Width: 0.8mm; Mount: Surface Mount; Package Quantity: 1
C22 C23 = CMP-2006-03061-2: CAP CER 0.1UF 50V X7R 0603; Manufacturer: KEMET; Manufacturer Part Number: C0603C104K5RACTU; Tolerance: 0.1; Temperature Coefficient: 30ppm/°C; Material: Ceramic; Automotive Grade: Grade 1; Value: 0.10 μF; Temperature: -55°C to +125°C; RoHS: TRUE; Temperature Range High: +125°C; Lead Free: Yes; Octopart: https://octopart.com/c0603c104k5ractu-kemet-139244; Digikey Description: CAP CER 0.1UF 50V X7R 0603; Category: Cap; Package: C0603C-CF; ComponentLink2Description: Datasheet; Temperature Range Low: -55°C; Device Class L1: Passive Components; Voltage Rating: 50 V; Automotive: Yes; Device Class L3: Ceramic Capacitors; ComponentLink2URL: https://api.kemet.com/component-edge/download/datasheet/C0603C100J5GACAUTO.pdf; Capacitance: 0.10 μF; Device Class L2: Capacitors; Temperature Characteristic: X7R; Height: 0.87mm
C24 C25 = CMP-2006-02672-1: Manufacturer: Murata; Part Number: GRM1885C1H470JA01D
CBUS2 RXD TXD = Test Points
D9 D11 = CMP-020-000009-1: Schottky Diode; Manufacturer_Name: Toshiba; Mouser Part Number: 757-CUS551V30H3F; Arrow Price/Stock: https://www.arrow.com/en/products/cus551v30h3f/toshiba; Mouser Price/Stock: https://www.mouser.co.uk/ProductDetail/Toshiba/CUS551V30H3F?qs=%252B8yZ8wZTKG7VmjE5ZJgf8Q%3D%3D; Manufacturer_Part_Number: CUS551V30,H3F; Source: SamacSys.SchLib; Datasheet Link: http://toshiba.semicon-storage.com/info/docget.jsp?did=10394&prodName=CUS551V30; Arrow Part Number: CUS551V30,H3F; Height: 1mm; Design Item ID: CUS551V30,H3F
D10 D12 = CMP-12225-000058-1: TVS DIODE 5.25V 17V SOT666; Min Breakdown Voltage: 6V; Power Line Protection: Yes; Element Configuration: Dual; Test Current: 1mA; Working Voltage: 5V; Number of Channels: 2; Max Reverse Leakage Current: 150nA; Direction: Unidirectional; Peak Pulse Current: 5A; Number of Elements: 1; Capacitance: 3.5pF; Max Breakdown Voltage: 6V; Height: 0.6mm; Depth: 1.3mm; Contact Plating: Tin; Reverse Breakdown Voltage: 6V; REACH SVHC: No SVHC; Operating Supply Voltage: 5V; Width: 1.3mm; Max Operating Temperature: 125°C; Reverse Standoff Voltage: 5V; ESD Protection: Yes; Package Quantity: 1; Termination: SMD/SMT; Length: 1.7mm; Leakage Current: 150nA; Number of Bidirectional Channels: 2; Case/Package: SOT-666; Min Operating Temperature: -40°C; Number of Pins: 6; Clamping Voltage: 17V; Breakdown Voltage: 6V; Lead Free: Lead Free; Radiation Hardening: No; Packaging: Tape and Reel; Mount: Surface Mount; Polarity: Unidirectional
FB2 FB3 = CMP-00002-2: Ferrite Beads Multi-Layer 120Ohm 25% 100MHz 3A 30mOhm DCR 0805 Paper T/R; Manufacturer_Name: Murata; Material: Steel,Ferrite; Impedance: 120R; Case/Package: 0805; Case Code (Imperial): 0805; Min Operating Temperature: -55°C; Max Operating Temperature: 125°C; Manufacturer_Part_Number: BLM21PG121SN1D
IC2 = CMP-009-000001-1: Integrated Circuit; Manufacturer_Name: FTDI Chip; Mouser Price/Stock: https://www.mouser.co.uk/ProductDetail/FTDI/FT230XQ-R?qs=Gp1Yz1mis3VvmXwyDmIHOg%3D%3D; Height: 0.8mm; Mouser Part Number: 895-FT230XQ-R; Source: SamacSys.SchLib; Design Item ID: FT230XQ-R; Datasheet Link: https://componentsearchengine.com/Datasheets/1/FT230XQ-R.pdf; Manufacturer_Part_Number: FT230XQ-R
J2 J3 = CMP-002-00177-2: USB Connector, USB Type C, USB 2.0, Receptacle, 16 Ways, Surface Mount, Right Angle; Manufacturer_Name: Hirose; Mating Cycles: 10000; Shielding: Shielded; Number of Ports: 1; Voltage Rating: 20V; Flammability Rating: UL94 V-0; RoHS Compliant: Yes; Packaging: Cut Tape; Pins: 16; Insulation Color: Black; Contact Plating: Gold; Gender: Receptacle; Height: 1.7mm; Termination: Solder; Contact Material: Nickel,Gold; Connector Type: USB; Series: CX; Max Operating Temperature: 85°C; Min Operating Temperature: -30°C; Mounting Technology: Surface Mount,Through Hole,Edge,Board,Horizontal; Manufacturer_Part_Number: CX90M-16P
R8 R9 R12-R14 = CMP-1012-00708-2: as R2 on sheet Microcontroller
R10 R11 = CMP-2000-00396-2: RES SMD 27 OHM 1% 1/10W 0603; Max Power Dissipation: 100mW; Resistance: 27R; Voltage Rating: 75V; Temperature Coefficient: 100ppm/°C; Number of Pins: 2; Case Code (Imperial): 0603; Resistance Tolerance: 1%; Max Operating Temperature: 155°C; Min Operating Temperature: -55°C; Termination: SMD/SMT; Length: 1.6mm; Resistor Type: Thick Film; Tolerance: 1%; Packaging: Tape and Reel; Radiation Hardening: No; Series: ERJ; Depth: 0.8mm; RoHS Compliant: Yes; Lead Free: Lead Free; Height: 0.022inch; Width: 0.031inch; Mount: Surface Mount; Contact Plating: Tin; Number of Terminations: 2; Features: Automotive AEC-Q200; Military Standard: Not; Power Rating: 100mW; Package Quantity: 1; Case/Package: 0603; Construction: Rectangular; Voltage Rating (DC): 75V; Case Code (Metric): 1608
RX1 = CMP-007-00024-3: as D1 on sheet Power; Manufacturer URL: http://www.us.liteon.com/; Case/Package: 0603; Datasheet Version: Rev. F, 05/2013; Package Reference: C191KRKT; Datasheet URL: http://optoelectronics.liteon.com/upload/download/DS-22-99-0151/S_110_LTST-C190KRKT.pdf; Package Description: 2-Pin Surface Mount Device, Body 1.6 x 0.8 mm; Nominal Vf: 2V; Packaging: TapeandReel; RoHS Compliant: True; Pins: 2; Illumination Colour: Red; Colour: Red; Mounting Technology: SM; Package Quantity: 3000; Min Operating Temperature: -55°C; Max Operating Temperature: 85°C; Manufacturer_Part_Number: LTST-C190KRKT

## Sheet KeyPad.SchDoc: Key Pad
size 420 x 297 mm; Date: UNUSED; Author: RT; CompanyName: CMT; DrawnBy: UNUSED; Engineer: UNUSED; Organization: Curtin Motorsport Team; Address1: Rm 151 Building 206; Address2: Curtin University; Address3: Kent Street, Bently; Address4: Western Australia; DocumentNumber: UNUSED; Revision: UNUSED; SheetNumber: 4; SheetTotal: 5; Year: UNUSED; SheetSize: A3; Time: UNUSED; ImagePath: UNUSED; Application_BuildNumber: UNUSED
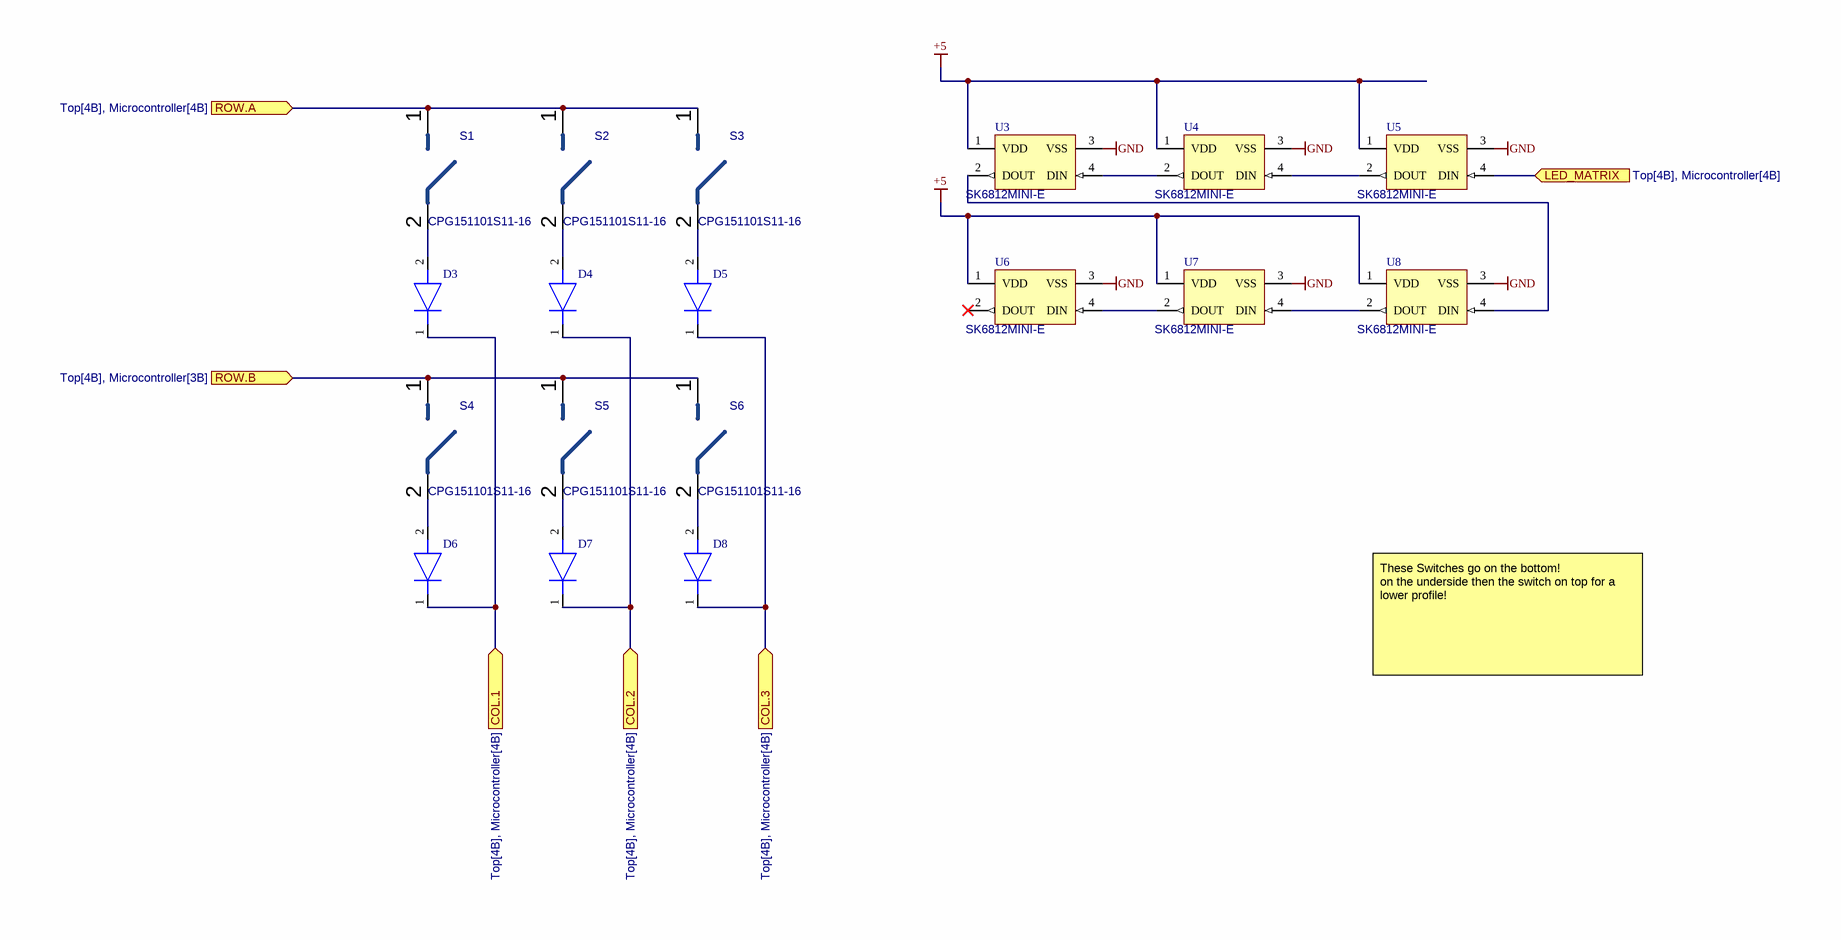
[diagram p4: KeyPad.SchDoc]

### Parts
D3  NSVR1020MW2T1G  [SOD2512X110N]  (value not drawn)
D4  NSVR1020MW2T1G  [SOD2512X110N]  (value not drawn)
D5  NSVR1020MW2T1G  [SOD2512X110N]  (value not drawn)
D6  NSVR1020MW2T1G  [SOD2512X110N]  (value not drawn)
D7  NSVR1020MW2T1G  [SOD2512X110N]  (value not drawn)
D8  NSVR1020MW2T1G  [SOD2512X110N]  (value not drawn)
S1  CPG151101S11-16  [CPG151101S11-16-Footprint-1]
S2  CPG151101S11-16  [CPG151101S11-16-Footprint-1]
S3  CPG151101S11-16  [CPG151101S11-16-Footprint-1]
S4  CPG151101S11-16  [CPG151101S11-16-Footprint-1]
S5  CPG151101S11-16  [CPG151101S11-16-Footprint-1]
S6  CPG151101S11-16  [CPG151101S11-16-Footprint-1]
U3  SK6812MINI-E  [Copy of ADAI-WS2812B_V]
U4  SK6812MINI-E  [Copy of ADAI-WS2812B_V]
U5  SK6812MINI-E  [Copy of ADAI-WS2812B_V]
U6  SK6812MINI-E  [Copy of ADAI-WS2812B_V]
U7  SK6812MINI-E  [Copy of ADAI-WS2812B_V]
U8  SK6812MINI-E  [Copy of ADAI-WS2812B_V]

### Ports
COL.1 (in, see Top[4B], Microcontroller[4B]), COL.2 (in, see Top[4B], Microcontroller[4B]), COL.3 (in, see Top[4B], Microcontroller[4B]), LED_MATRIX (in, see Top[4B], Microcontroller[4B]), ROW.A (in, see Top[4B], Microcontroller[4B]), ROW.B (in, see Top[4B], Microcontroller[3B])

### Nets
+5: U3.1(VDD) U4.1(VDD) U5.1(VDD) U6.1(VDD) U7.1(VDD) U8.1(VDD)
GND: U3.3(VSS) U4.3(VSS) U5.3(VSS) U6.3(VSS) U7.3(VSS) U8.3(VSS)
IO.8: S4.1 S5.1 S6.1 ; port ROW.B
NetD3_1: D3.1(K) D6.1(K) ; port COL.1
NetD3_2: D3.2(A) S1.2
NetD4_1: D4.1(K) D7.1(K) ; port COL.2
NetD4_2: D4.2(A) S2.2
NetD5_1: D5.1(K) D8.1(K) ; port COL.3
NetD5_2: D5.2(A) S3.2
NetD6_2: D6.2(A) S4.2
NetD7_2: D7.2(A) S5.2
NetD8_2: D8.2(A) S6.2
NetS1_1: S1.1 S2.1 S3.1 ; port ROW.A
NetU1_18: U5.4(DIN) ; port LED_MATRIX
NetU3_2: U3.2(DOUT) U8.4(DIN)
NetU3_4: U3.4(DIN) U4.2(DOUT)
NetU4_4: U4.4(DIN) U5.2(DOUT)
NetU6_4: U6.4(DIN) U7.2(DOUT)
NetU7_4: U7.4(DIN) U8.2(DOUT)

Not connected (* = marked no-connect by the designer): U6 2(DOUT)*

### Notes on the sheet
- These Switches go on the bottom!
  on the underside then the switch on top for a lower profile!
- Project:
- Title:
- Project Number:
- Size:
- Status:
- Revision:
- Year:
- Design Date:
- Author:
- Latest Revision Date:
- Sheet
- Checked:
- Checked
- of
- Date:

### Library data of the parts
D3-D8 = CMP-020-000003-1: Diode; Manufacturer_Name: onsemi; Design Item ID: NSVR1020MW2T1G; Datasheet Link: http://www.onsemi.com/pub/Collateral/NSR1020MW2T1-D.PDF; Arrow Price/Stock: https://www.arrow.com/en/products/nsvr1020mw2t1g/on-semiconductor; Height: 1.1mm; Mouser Part Number: 863-NSVR1020MW2T1G; Mouser Price/Stock: https://www.mouser.co.uk/ProductDetail/onsemi/NSVR1020MW2T1G?qs=tCMd4XlZ%2FiDUu7qH%252Bxas4w%3D%3D; Manufacturer_Part_Number: NSVR1020MW2T1G; Source: SamacSys.SchLib; Arrow Part Number: NSVR1020MW2T1G
S1-S6 = CMP-011-00039-6: Manufacturer_Name: Kalih; Current Rating: 10mA; Throw Configuration: SPST; Max Current Rating: 1A; Voltage Rating: 12V; Purchasing Link 3: https://www.amazon.com.au/Hot-swap-CPG151101S11-Mechanical-Keyboard-Accessories/dp/B0BVH6M5FP?th=1; Pins: 2; Max Operating Temperature: 60°C; Purchasing Link 2: https://www.gateron.com/products/gateron-hot-swap-pcb-socket?VariantsId=10170; Min Operating Temperature: -10°C; Purchasing Link: https://www.digikey.com.au/en/products/detail/adafruit-industries-llc/4958/13997772; Mounting Technology: SMT; RoHS Compliant: -; Manufacturer_Part_Number: CPG151101S11-16
U3-U8 = CMP-007-00047-8: Intelligent Control LED Integrated Light Source, 3.5 to 5.3 V, -25 to 80 degC, 4-Pin SMD, RoHS, Bulk; Manufacturer: Adafruit Industries; Manufacturer_Name: Dongguan Opsco; Forward Current: 10mA; Forward Voltage: 5.5V; Colour: RGB Addressable; Manufacturer URL: https://www.adafruit.com/; Datasheet Version: May-13; Max Operating Temperature: 85°C; Case/Package: 6028; Pins: 4; Mounting Technology: BOTTOM MOUNT SMT; RoHS Compliant: False; Package Description: 4-Pin Surface Mount Device, Body 5 x 5 mm, Pitch 3.3 mm; Package Reference: SK6812MINI-E; Manufacturer_Part_Number: SK6812MINI-E

## Nets that join several sheets
3V3: Power (3V3.1 FB1.2 R1.2), Microcontroller (11 pins), USB (5 pins)
+5: Power (C1.1 C2.1 IC1.1 IC1.3), Microcontroller (C10.1 SB1.3 U2.1), USB (9 pins), KeyPad (6 pins)
GND: Power (6 pins), Microcontroller (25 pins), USB (32 pins), KeyPad (6 pins)
CBUS3: Microcontroller (Q1.1 R7.1), USB (IC2.14)
DIR.D_N: Microcontroller (U1.13), USB (D12.4)
DIR.D_P: Microcontroller (U1.14), USB (D12.6)
IO.8: Microcontroller (U1.10), KeyPad (S4.1 S5.1 S6.1)
NetD3_1: Microcontroller (U1.23), KeyPad (D3.1 D6.1)
NetD4_1: Microcontroller (U1.16), KeyPad (D4.1 D7.1)
NetD5_1: Microcontroller (U1.17), KeyPad (D5.1 D8.1)
NetIC2_16: Microcontroller (Q1.4 R5.1), USB (IC2.16)
NetS1_1: Microcontroller (U1.11), KeyPad (S1.1 S2.1 S3.1)
NetU1_18: Microcontroller (U1.18), KeyPad (U5.4)
RXD: Microcontroller (U1.25), USB (IC2.2 RXD.1)
TXD: Microcontroller (U1.24), USB (IC2.15 TXD.1)